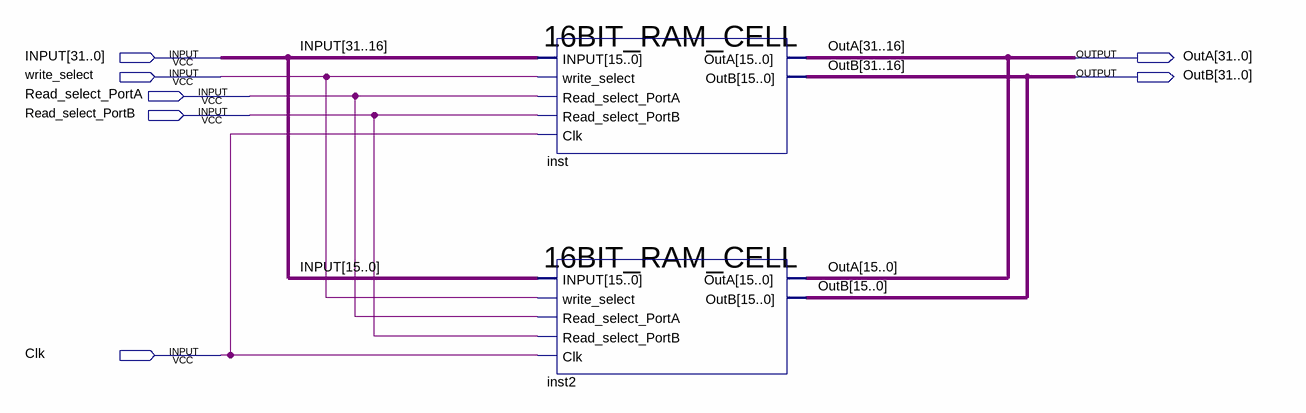
[diagram p0: schematic sheet]
// Quartus schematic 32BIT_RAM_CELL.bdf as structural Verilog: 2 symbols, 7 pins
module \32BIT_RAM_CELL  (
  input  [31:0] INPUT,
  input  write_select,
  input  Read_select_PortA,
  input  Read_select_PortB,
  input  Clk,
  output [31:0] OutA,
  output [31:0] OutB
);

  \16BIT_RAM_CELL  inst (
    .INPUT(INPUT[31:16]), .write_select(write_select), .Read_select_PortA(Read_select_PortA),
    .Read_select_PortB(Read_select_PortB), .Clk(Clk), .OutA(OutA[31:16]), .OutB(OutB[31:16]));
  \16BIT_RAM_CELL  inst2 (
    .INPUT(INPUT[15:0]), .write_select(write_select), .Read_select_PortA(Read_select_PortA),
    .Read_select_PortB(Read_select_PortB), .Clk(Clk), .OutA(OutA[15:0]), .OutB(OutB[15:0]));
endmodule
